# EAGLE design H1DR1x-T (EAGLE 9.6.1)

## Sheet 1 of 2
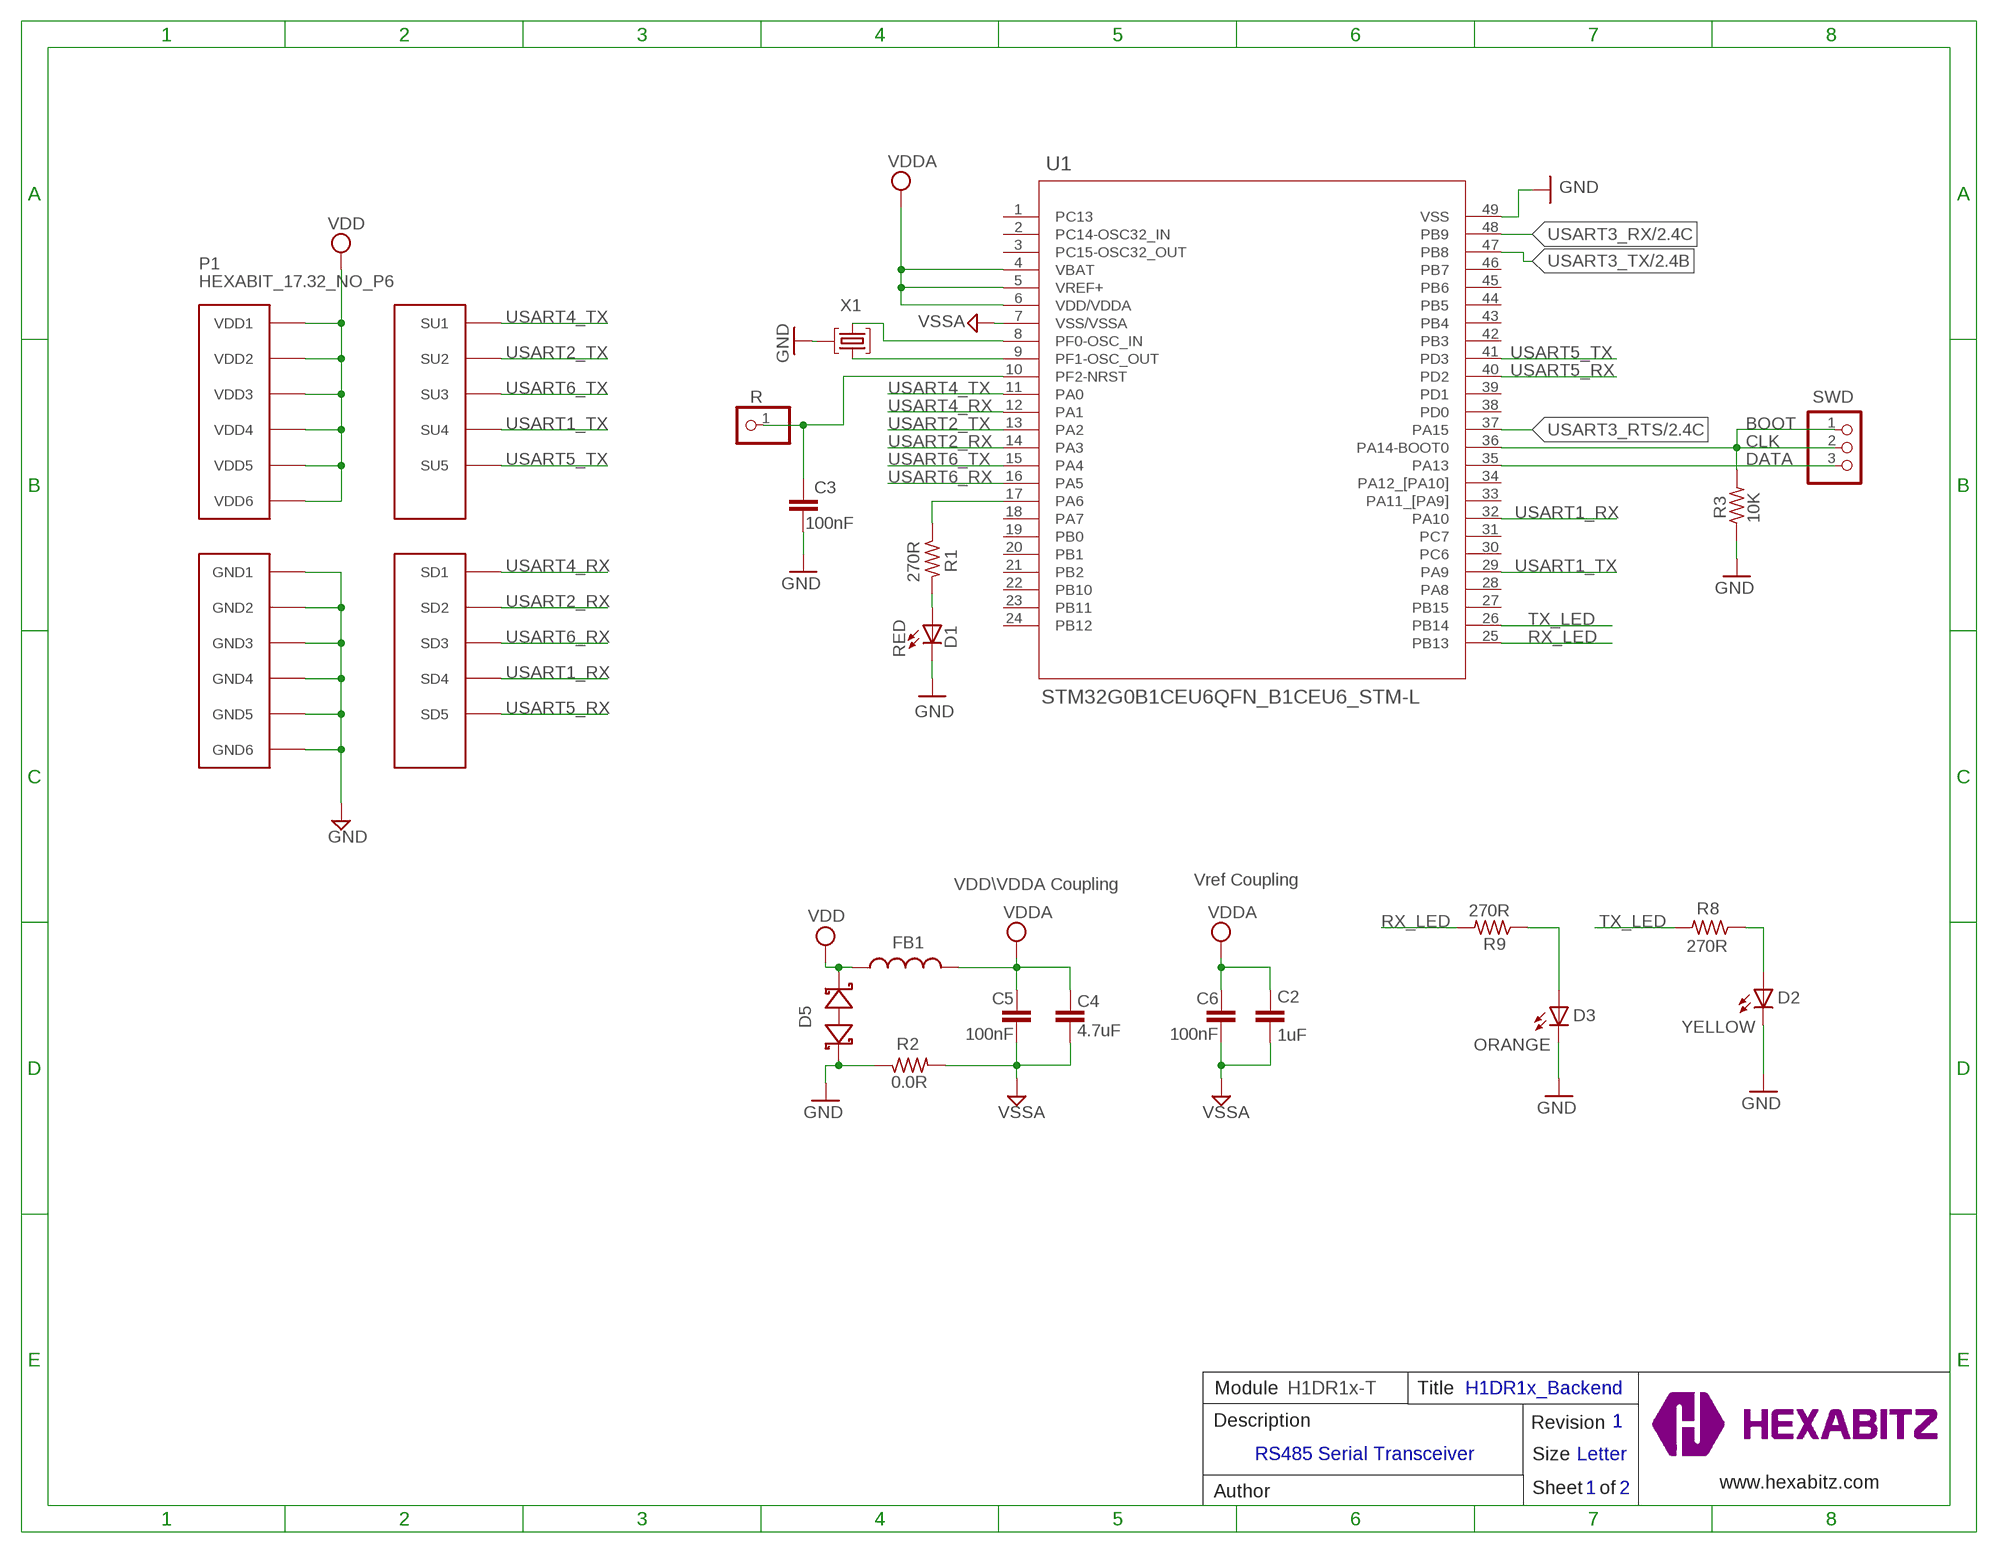
[diagram p0: schematic, sheet 1]

### Parts
C2  1uF  C-0805  [C-0805]
C3  100nF  C-0603  [C-0603]
C4  4.7uF  C-0805  [C-0805]
C5  100nF  C-0603  [C-0603]
C6  100nF  C-0603  [C-0603]
D1  RED  VLMS1300-GS08  [VLMS1300-GS08]
D2  YELLOW  VLMS1300-GS08  [VLMS1300-GS08]
D3  ORANGE  VLMS1300-GS08  [VLMS1300-GS08]
D5  BOURNS_CDSOD323-T03SCBOURNS_CDSOD323-T03SC_0_0  [BOURNS_CDSOD323-T03SC_0]
FB1  FB-TDK_MMZ1608Y300B  FB-0603  [FB-0603]
P1  HEXABIT_17.32_NO_P6  [HEXABIT_17.32_NO_P6]
R  R  PINHD-1X1  [1X01]
R1  270R  R-0603  [R-0603]
R2  0.0R  R-0603  [R-0603]
R3  10K  R-0603  [R-0603]
R8  270R  R-0603  [R-0603]
R9  270R  R-0603  [R-0603]
SWD  PINHD-1X3  [1X03]
TRIMBLE-LOGO1  HEXA-LOGO  [HEXA-LOGO]
U1  STM32G0B1CEU6QFN_B1CEU6_STM-L  [QFN_B1CEU6_STM-L]
X1  XTALL_CSTCE8M00G52  [XTALL_CSTCE8M00G52]

### Nets
CLK: R3.2 SWD.1 SWD.2 U1.36(PA14-BOOT0)
DATA: SWD.3 U1.35(PA13)
GND: C3.2 D1.C D2.C D3.C D5.1(A) P1.PAD_PD7(GND1) P1.PAD_PD8(GND2) P1.PAD_PD9(GND3) P1.PAD_PD10(GND4) P1.PAD_PD11(GND5) P1.PAD_PD12(GND6) R2.1 R3.1 U1.49(VSS) X1.P$2 ; also sheet 2
N$1: D1.A R1.2
N$3: R1.1 U1.17(PA6)
N$4: C3.1 R.1 U1.10(PF2-NRST)
N$5: U1.9(PF1-OSC_OUT) X1.P$1
N$6: U1.8(PF0-OSC_IN) X1.P$3
N$12: D3.A R9.1
N$13: D2.A R8.1
RX_LED: R9.2 U1.25(PB13)
TX_LED: R8.2 U1.26(PB14)
USART1_RX: P1.PAD_PD4(SD4) U1.32(PA10)
USART1_TX: P1.PAD_PU4(SU4) U1.29(PA9)
USART2_RX: P1.PAD_PD2(SD2) U1.14(PA3)
USART2_TX: P1.PAD_PU2(SU2) U1.13(PA2)
USART3_RTS: U1.37(PA15) ; also sheet 2
USART3_RX: U1.48(PB9) ; also sheet 2
USART3_TX: U1.47(PB8) ; also sheet 2
USART4_RX: P1.PAD_PD1(SD1) U1.12(PA1)
USART4_TX: P1.PAD_PU1(SU1) U1.11(PA0)
USART5_RX: P1.PAD_PD5(SD5) U1.40(PD2)
USART5_TX: P1.PAD_PU5(SU5) U1.41(PD3)
USART6_RX: P1.PAD_PD3(SD3) U1.16(PA5)
USART6_TX: P1.PAD_PU3(SU3) U1.15(PA4)
VDD: D5.2(C) FB1.2 P1.PAD_PU7(VDD1) P1.PAD_PU8(VDD2) P1.PAD_PU9(VDD3) P1.PAD_PU10(VDD4) P1.PAD_PU11(VDD5) P1.PAD_PU12(VDD6) ; also sheet 2
VDDA: C2.1 C4.1 C5.1 C6.1 FB1.1 U1.4(VBAT) U1.5(VREF+) U1.6(VDD/VDDA)
VSSA: C2.2 C4.2 C5.2 C6.2 R2.2 U1.7(VSS/VSSA)
Unconnected: U1.1(PC13) U1.2(PC14-OSC32_IN) U1.3(PC15-OSC32_OUT) U1.18(PA7) U1.19(PB0) U1.20(PB1) U1.21(PB2) U1.22(PB10) U1.23(PB11) U1.24(PB12) U1.27(PB15) U1.28(PA8) U1.30(PC6) U1.31(PC7) U1.33(PA11_[PA9]) U1.34(PA12_[PA10]) U1.38(PD0) U1.39(PD1) U1.42(PB3) U1.43(PB4) U1.44(PB5) U1.45(PB6) U1.46(PB7)

### Notes on the sheet
- BOOT
- VDD\VDDA Coupling | Vref Coupling
- Module | H1DR1x-T | Title | H1DR1x_Backend
- Description | Revision | 1
- RS485 Serial Transceiver
- Size | Letter
- www.hexabitz.com
- Author | Sheet   of | 1 | 2
- C:/Users/Admin/Desktop/logodraft.bmp

## Sheet 2 of 2
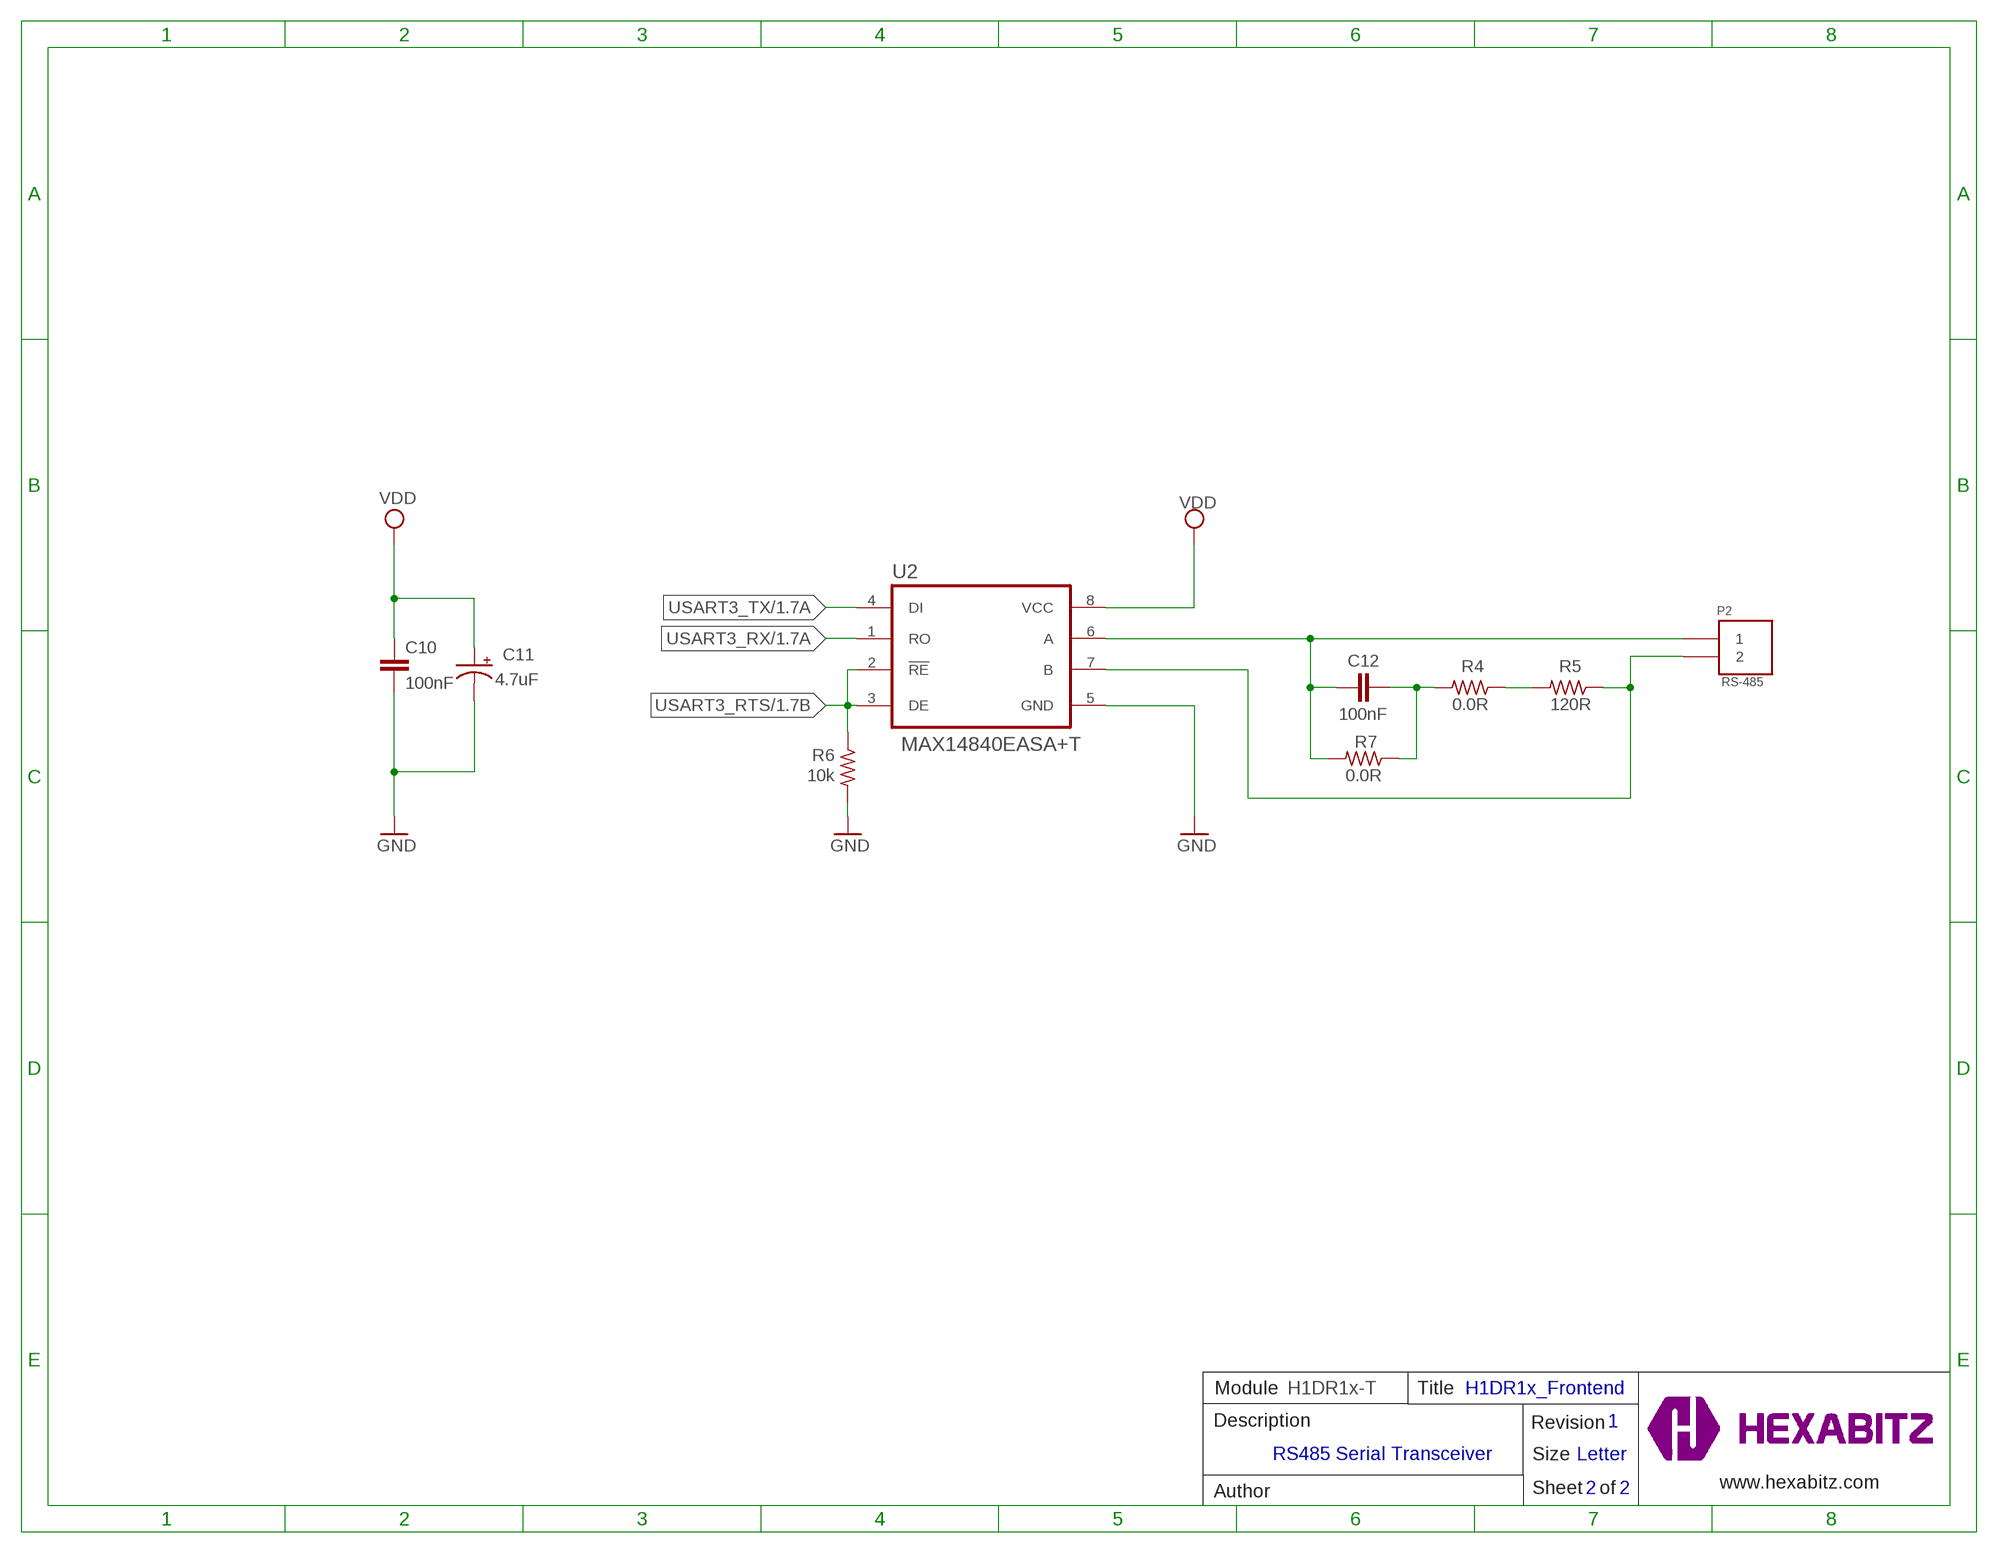
[diagram p1: schematic, sheet 2]

### Parts
C10  100nF  C-0603  [C-0603]
C11  4.7uF  C-0805-POL  [C-0805-POL]
C12  100nF  C-0603  [C-0603]
P2  RS-485  1546111-2  [1546111-2]
R4  0.0R  R-0603  [R-0603]
R5  120R  R-0603  [R-0603]
R6  10k  R-0603  [R-0603]
R7  0.0R  R-0603  [R-0603]
U2  MAX14840EASA+T  [SOIC127P600X175-8N]

### Nets
GND: C10.2 C11.2(-) R6.2 U2.5(GND) ; also sheet 1
N$2: C12.2 R4.2 R7.1
N$10: R4.1 R5.2
TA: C12.1 P2.1 R7.2 U2.6(A)
TB: P2.2 R5.1 U2.7(B)
USART3_RTS: R6.1 U2.2(!RE) U2.3(DE) ; also sheet 1
USART3_RX: U2.1(RO) ; also sheet 1
USART3_TX: U2.4(DI) ; also sheet 1
VDD: C10.1 C11.1(+) U2.8(VCC) ; also sheet 1

### Notes on the sheet
- Module | H1DR1x-T | Title | H1DR1x_Frontend
- Description | Revision | 1
- RS485 Serial Transceiver
- Size | Letter
- www.hexabitz.com
- Author | Sheet   of | 2 | 2

## Library data of the parts
C2 C4 = HEXABITZ_RCLS:C-0805: CAP CER 10% X7R 0805
C3 C5 C6 = HEXABITZ_RCLS:C-0603: CAP CER 10% X7R 0603
C10 = HEXABITZ_RCLS:C-0603: CAP CER 10% X7R 0603; CAPACITANCE: 100nF; MFN: KEMET; MPN: C0603C104K8RACTU; OCTOPART_URL: https://octopart.com/c0603c104k8ractu-kemet-145075?r=sp&s=9bS9ASSwSEqMCE9KBEQZ0g; TOLERANCE: 10%; VOLTAGE_RATING: 10V
C11 = HEXABITZ_RCLS:C-0805-POL: Cap Tant Solid SMD 2012; CAPACITANCE: 4.7uF; MFN: Murata; MPN: GRM21BC81E475KA12L; OCTOPART_URL: https://octopart.com/grm21bc81e475ka12l-murata-10331911?r=sp&s=RY3qZSD8T6mG6TC9CHI5qQ; TOLERANCE: 10%; VOLTAGE_RATING: 25V
C12 = HEXABITZ_RCLS:C-0603: CAP CER 10% X7R 0603; CAPACITANCE: 100nF; MFN: AVX; MPN: 0603YC104K4T2A; OCTOPART_URL: https://octopart.com/0603yc104k4t2a-avx+interconnect+%2F+elco-8120651; TOLERANCE: 10%; VOLTAGE_RATING: 16V
D1 = HEXABITZ_USER_INTERFACE_PARTS:VLMS1300-GS08: Red 0603 130° Clear 54 mcd 2 V Surface Mount ChipLED ; Octopart Url : http://octopart.com/vlms1300-gs08-vishay-21709201; MFN: Vishay; MPN: VLMS1300-GS08; OCTOPART_URL: https://octopart.com/vlms1300-gs08-vishay-21709201?r=sp&s=_gcP4_q8T1SC6PJQPTQ9yA
D2 D3 = HEXABITZ_USER_INTERFACE_PARTS:VLMS1300-GS08: Red 0603 130° Clear 54 mcd 2 V Surface Mount ChipLED ; Octopart Url : http://octopart.com/vlms1300-gs08-vishay-21709201; MFN: Vishay; MPN: VLMS1300-GS08; OCTOPART_URL: https://octopart.com/vlms1300-gs08-vishay-21709201?r=sp&s=_gcP4_q8T1SC6PJQPTQ9yA; VALUE: RED
D5 = HEXABITZ_RCLS:BOURNS_CDSOD323-T03SC: CDSOD323-TxxSC - TVS Diode Series; DESCRIPTION: Dio Tvs Vwm 03V 500W Bidir Sod323 / Tape & Reel - 7" Reel; MFN: Bourns; MPN: CDSOD323-T03SC; OCTOPART_URL: https://octopart.com/cdsod323-t03sc-bourns-10487153?r=sp
FB1 = HEXABITZ_RCLS:FB-0603: Ferrite Beads Multi-Layer 0603; MFN: TDK; MPN: MMZ1608Y300B; OCTOPART_URL: https://octopart.com/mmz1608y300b-tdk-368280?r=sp&s=cd9_2ZEqQ9q9UNBuQgHAiA
P1 = hexabitz_connectors:HEXABIT_?_NO_P6: Hexabitz Hexagon Module Connector Hexagon side length = 17.32mm. The following ports are removed: P6
P2 = HEXABITZ_CONNECTION_PARTS:1546111-2: Conn Shrouded Header HDR 2 POS 5.08mm Solder ST Thru-Hole; MFN: TE Connectivity; MPN: 1546111-2; OCTOPART_URL: https://octopart.com/1546111-2-te+connectivity-40393355
R = HEXABITZ_USER_INTERFACE_PARTS:PINHD-1X1: PIN HEADER; MFN: TE Connectivity; MPN: 87227-1; OCTOPART_URL: https://octopart.com/87227-1-te+connectivity-39512052?r=sp
R1 R3 R8 R9 = HEXABITZ_RCLS:R-0603: Thick Film Resistors - SMD 0603
R2 = HEXABITZ_RCLS:R-0603: Thick Film Resistors - SMD 0603; MFN: Yageo; MPN: RC0603JR-070RL; OCTOPART_URL: https://octopart.com/rc0603jr-070rl-yageo-1241539?r=sp&s=X2NteqRjRNWrnx42Y0aliA; RESISTANCE: 0.0 Ohm
R4 R7 = HEXABITZ_RCLS:R-0603: Thick Film Resistors - SMD 0603; MFN: Vishay; MPN: CRCW06030000Z0EA; OCTOPART_URL: https://octopart.com/crcw06030000z0ea-vishay-39556096#; RESISTANCE: 0.0 Ohm
R5 = HEXABITZ_RCLS:R-0603: Thick Film Resistors - SMD 0603; MFN: Panasonic; MPN: ERJP6WF1200V; OCTOPART_URL: https://octopart.com/erjp6wf1200v-panasonic-25949195?r=sp#; POWER_DISSIPATION: 0.5W; RESISTANCE: 120R; TOLERANCE: 1%
R6 = HEXABITZ_RCLS:R-0603: Thick Film Resistors - SMD 0603; MFN: Vishay; MPN: CRCW060310K0JNEB; OCTOPART_URL: https://octopart.com/crcw060310k0jneb-vishay+dale-46603268; RESISTANCE: 10k; TOLERANCE: 5%
SWD = pinhead:PINHD-1X3: PIN HEADER
TRIMBLE-LOGO1 = HEXABITZ_USER_INTERFACE_PARTS:HEXA-LOGO: Trimble-Logo
U1 = HEXABITZ_ICs:STM32G0B1CEU6; COPYRIGHT: Copyright (C) 2021 Ultra Librarian. All rights reserved.; MANUFACTURER_PART_NUMBER: STM32G0B1CEU6; MFR_NAME: STMicroelectronics; SPICEPREFIX: X
U2 = HEXABITZ_ICs:MAX14840EASA+T: Check availability <https://pricing.snapeda.com/parts/MAX14840EASA%2BT/Analog%20Devices/view-part?ref=eda>; AVAILABILITY: In Stock; CHECK_PRICES: https://www.snapeda.com/parts/MAX14840EASA+T/Analog+Devices/view-part/?ref=eda; DESCRIPTION: 40Mbps, +3.3V, RS-485 Half-Duplex Transceivers; MF: Analog Devices; MP: MAX14840EASA+T; PACKAGE: SOIC-8 Maxim; PRICE: None; SNAPEDA_LINK: https://www.snapeda.com/parts/MAX14840EASA+T/Analog+Devices/view-part/?ref=snap
X1 = HEXABITZ_RCLS:XTALL_CSTCE8M00G52: MURATA CSTCE8M00G52-R0 RESONATOR, SMD, 8MHZ ; Octopart Url : https://octopart.com/cstce8m00g52-r0-murata-7145559; MFN: Murata; MPN: CSTCE8M00G52Z-R0; OCTOPART_URL: https://octopart.com/cstce8m00g52z-r0-murata-17755941?r=sp&s=JDnNJnrHQhyS8Zk4ofFWXw

## Board
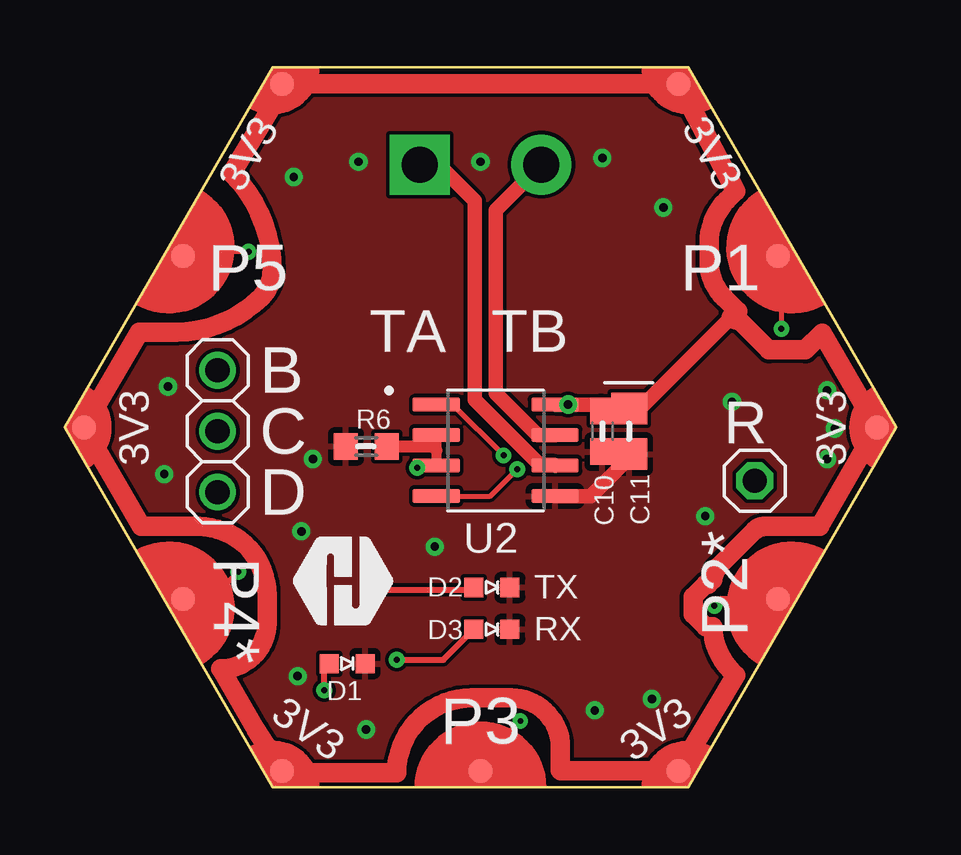
[diagram p2: board, top side]
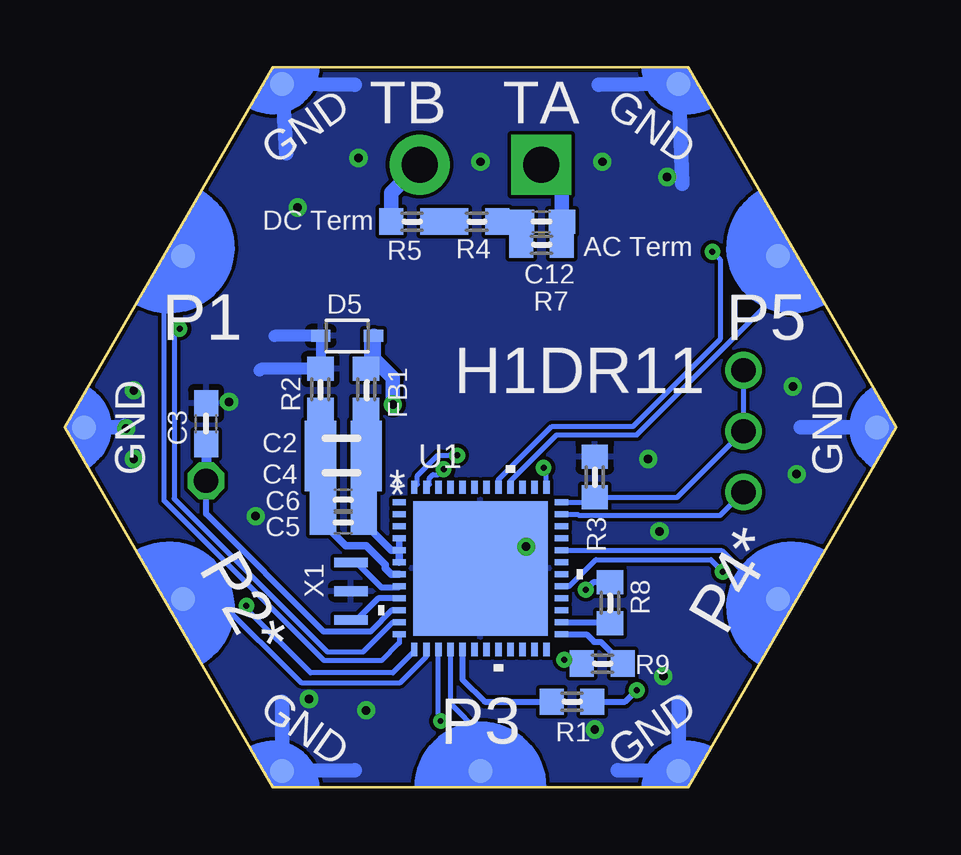
[diagram p3: board, bottom side, seen from below]

Size 34.64 x 30 mm. Coordinates in mm from the lower left corner, seen from the top.
Copper layers (1*16): Top 0.035mm / dielectric 1.5mm / Bottom 0.035mm
Design rules "2_layer *": minimum track width 7mil, minimum drill 9mil, track to track 6mil, track to pad 6mil, pad to pad 6mil, via to via 6mil, smd to smd 0mil, copper to edge 0.15mm, drill to drill 8mil, minimum pad ring 10mil, minimum via ring 8mil, stop-mask expansion 2mil, vias tented up to drill 15mil, thermal gap 10mil

### Footprints (pad centres in the part's own frame; a part is rotated, then mirrored left to right if it is on the bottom)
C-0805 = smd 1.3 x 1.5: 1 -0.95,0; 2 0.95,0
C-0603 = smd 1.1 x 1: 1 -0.85,0; 2 0.85,0
C-0805-POL = smd 1.3 x 1.5: 1 -0.95,0; 2 0.95,0
VLMS1300-GS08 = smd 0.8 x 0.8: A 0,0.75; C 0,-0.75
BOURNS_CDSOD323-T03SC_0 = smd 0.8 x 0.5: 1 -1.1,0; 2 1.1,0
FB-0603 = smd 1 x 1.1: 1 -0.85,0; 2 0.85,0
HEXABIT_17.32_NO_P6 = smd 1 x 1 bottom: PAD_PD1 12.39,7.15; PAD_PD2 12.39,-7.15; PAD_PD3 0,-14.31; PAD_PD4 -12.39,-7.15; PAD_PD5 -12.39,7.15; PAD_PD7 8.26,14.31; PAD_PD8 16.52,0; PAD_PD9 8.26,-14.31; PAD_PD10 -8.26,-14.31; PAD_PD11 -16.52,0; PAD_PD12 -8.26,14.31 | smd 1 x 1: PAD_PU1 12.39,7.15; PAD_PU2 12.39,-7.15; PAD_PU3 0,-14.31; PAD_PU4 -12.39,-7.15; PAD_PU5 -12.39,7.15; PAD_PU7 8.26,14.31; PAD_PU8 16.52,0; PAD_PU9 8.26,-14.31; PAD_PU10 -8.26,-14.31; PAD_PU11 -16.52,0; PAD_PU12 -8.26,14.31
1546111-2 = drill 1.5 pad 2.5 square: 1 -2.54,0 | drill 1.5 pad 2.5: 2 2.54,0
1X01 = drill 1.016 octagon: 1 0,0
R-0603 = smd 1 x 1.1: 1 -0.85,0; 2 0.85,0
1X03 = drill 1.016: 1 -2.54,0; 2 0,0; 3 2.54,0
QFN_B1CEU6_STM-L = smd 0.55 x 0.254: 1 -3.38,2.751; 2 -3.38,2.251; 3 -3.38,1.75; 4 -3.38,1.25; 5 -3.38,0.75; 6 -3.38,0.25; 7 -3.38,-0.25; 8 -3.38,-0.75; 9 -3.38,-1.25; 10 -3.38,-1.75; 11 -3.38,-2.251; 12 -3.38,-2.751; 25 3.38,-2.751; 26 3.38,-2.251; 27 3.38,-1.75; 28 3.38,-1.25; 29 3.38,-0.75; 30 3.38,-0.25; 31 3.38,0.25; 32 3.38,0.75; 33 3.38,1.25; 34 3.38,1.75; 35 3.38,2.251; 36 3.38,2.751 | smd 0.254 x 0.55: 13 -2.751,-3.38; 14 -2.251,-3.38; 15 -1.75,-3.38; 16 -1.25,-3.38; 17 -0.75,-3.38; 18 -0.25,-3.38; 19 0.25,-3.38; 20 0.75,-3.38; 21 1.25,-3.38; 22 1.75,-3.38; 23 2.251,-3.38; 24 2.751,-3.38; 37 2.751,3.38; 38 2.251,3.38; 39 1.75,3.38; 40 1.25,3.38; 41 0.75,3.38; 42 0.25,3.38; 43 -0.25,3.38; 44 -0.75,3.38; 45 -1.25,3.38; 46 -1.75,3.38; 47 -2.251,3.38; 48 -2.751,3.38 | smd 5.6 x 5.6: 49 0,0
SOIC127P600X175-8N = smd 1.97 x 0.59: 1 -2.475,1.905; 2 -2.475,0.635; 3 -2.475,-0.635; 4 -2.475,-1.905; 5 2.475,-1.905; 6 2.475,-0.635; 7 2.475,0.635; 8 2.475,1.905
XTALL_CSTCE8M00G52 = smd 1.4 x 0.4: P$1 0,1.2; P$2 0,0; P$3 0,-1.2

### Placement (x,y rotation side)
C2  23.04,14.52 180 bottom
C3  28.75,15.16 90 bottom
C4  23.04,13.09 180 bottom
C5  23.04,11.03 180 bottom
C6  23.04,11.98 180 bottom
C10  22.4,14.84 270 top
C11  23.51,14.84 270 top
C12  14.78,23.57 180 bottom
D1  11.76,5.16 90 top
D2  17.8,8.33 90 top
D3  17.8,6.59 90 top
D5  22.88,18.81 0 bottom
FB1  22.08,16.59 90 bottom
P1  17.32,15 0 top
P2  17.32,25.95 0 top
R  28.75,12.78 90 top
R1  13.51,3.57 0 bottom
R2  23.99,16.59 270 bottom
R3  12.56,12.94 270 bottom
R4  17.48,23.57 0 bottom
R5  20.18,23.57 0 bottom
R6  12.56,14.21 180 top
R7  14.78,22.62 0 bottom
R8  11.92,7.7 270 bottom
R9  12.24,5.16 0 bottom
SWD  6.37,14.84 270 top
TRIMBLE-LOGO1  11.61,6.74 0 top
U1  17.32,9.13 0 bottom
U2  17.96,14.05 0 top
X1  22.72,8.17 180 bottom

### Tracks (layer width: path | path; a pad name or v marks a point on that pad's centre or on a via)
CLK
  Bottom 0.203: U1.36 12.77,11.88 R3.2 9.12,12.09 SWD.2 SWD.1
DATA
  Bottom 0.203: U1.35 13.26,11.38 13.21,11.33 7.34,11.33 SWD.3
GND  (via drill 0.35 pad 0.75)
  Top 0.508: C11.2 22.5,13.89 C10.2
  Top 0.61: U2.5 21.92,12.14 23.43,13.65 23.35,13.73 | 23.35,13.73 C11.2 | C10.2 23.09,13.99 23.35,13.73
  Bottom 0.406: D5.1 23.98,17.45 R2.1
  Bottom 0.508: D5.1 25.89,18.81 | R2.1 26.47,17.44 26.53,17.38 | U1.49 17.32,9.56 18.27,7.11
  Bottom 0.61: 9.06,3.57 P1.PAD_PD10 11.61,0.71 | P1.PAD_PD11 3.98,15 | 8.91,25.16 P1.PAD_PD12 12.4,29.29 | 22.56,29.29 P1.PAD_PD7 25.42,26.43 | 25.58,3.57 P1.PAD_PD9 22.56,0.71 | 18.27,7.11 18.11,10.24 | 32.16,15.07 32.09,15 P1.PAD_PD8 | U1.49 16.41,10.03 v15.42,10.03
  other vias: 32.08,14.96 31.77,16.54 31.77,13.69 27.8,16.07 26.69,11.3 9.7,4.64 12.56,2.41 22.08,3.21 24.46,3.68 4.3,16.7 4.14,13.05 9.54,25.43 12.24,26.07 17.32,26.07 24.94,24.16 22.4,26.23 9.86,10.67 10.34,13.69
  pour Bottom: 8.74,-0.02 26.06,-0.02 34.72,14.98 26.06,29.98 8.74,29.98 0.08,14.98
  pour Top: 8.74,-0.02 26.06,-0.02 34.72,14.98 26.06,29.98 8.74,29.98 0.08,14.98
N$1  (via drill 0.25 pad 0.55)
  Top 0.254: v10.81,4.05 10.81,4.95 D1.A
  Bottom 0.254: R1.2 11.29,3.57 v10.81,4.05
N$2
  Bottom 0.61: R4.2 C12.2 R7.1
N$3
  Bottom 0.254: U1.17 18.07,4.5 17.14,3.57 R1.1
N$4
  Bottom 0.203: 22.88,6.49 22.86,6.48
  Bottom 0.254: R.1 28.75,11.39 23.85,6.49 22.88,6.49 21.9,6.49 21.02,7.38 U1.10
  Bottom 0.406: C3.1 R.1
N$5
  Bottom 0.254: U1.9 21.59,7.88 22.49,6.97 X1.P$1
N$6
  Bottom 0.254: X1.P$3 22.49,9.37 21.45,8.33 20.74,8.33 U1.8
N$10
  Bottom 0.61: R4.1 R5.2
N$12  (via drill 0.25 pad 0.55)
  Top 0.254: v13.83,5.32 15.78,5.32 D3.A
  Bottom 0.254: R9.1 13.67,5.16 v13.83,5.32
N$13  (via drill 0.25 pad 0.55)
  Top 0.254: v12.94,8.24 16.95,8.24 D2.A
  Bottom 0.254: R8.1 12.63,8.55 v12.94,8.24
RX_LED
  Bottom 0.254: R9.2 12.3,6.07 12.59,6.07 12.9,6.38 U1.25
TA
  Top 0.61: P2.1 15.57,25.95 17.08,24.44 17.08,16.15 19.79,13.44 20.4,13.44 U2.6
  Bottom 0.61: P2.1 13.93,25.1 C12.1 R7.2
TB
  Top 0.61: U2.7 19.7,14.68 17.96,16.43 17.96,24.05 P2.2
  Bottom 0.61: R5.1 21.03,24.79 P2.2
TX_LED
  Bottom 0.254: U1.26 11.95,6.88 R8.2
USART1_RX
  Bottom 0.203: U1.32 7.27,9.88 5.25,7.85 P1.PAD_PD4
USART1_TX  (via drill 0.25 pad 0.55)
  Top 0.203: P1.PAD_PU4 6.09,7.85 v7.22,8.99
  Bottom 0.203: v7.22,8.99 7.72,9.49 12.51,9.49 13.62,8.38 U1.29
USART2_RX
  Bottom 0.203: P1.PAD_PD2 28.28,7.85 24.8,4.36 20.65,4.36 19.57,5.45 U1.14
USART2_TX  (via drill 0.25 pad 0.55)
  Top 0.254: P1.PAD_PU2 27.35,7.85 v27.07,7.57
  Bottom 0.203: U1.13 20.07,5.67 20.97,4.77 24.39,4.77 27.07,7.45 v27.07,7.57
USART3_RTS  (via drill 0.25 pad 0.55)
  Top 0.203: v14.69,13.32 14.78,13.41 U2.3
  Top 0.406: U2.2 15.48,14.05 U2.3
  Top 0.508: R6.1 15.32,14.21 15.48,14.05
  Bottom 0.203: U1.37 14.57,13.2 v14.69,13.32
USART3_RX  (via drill 0.25 pad 0.55)
  Top 0.203: v18.29,13.83 16.17,15.95 U2.1
  Bottom 0.203: U1.48 19.95,12.63 19.95,12.99 19.1,13.84 18.62,13.84 18.61,13.83 v18.29,13.83
USART3_TX  (via drill 0.25 pad 0.55)
  Top 0.203: U2.4 17.74,12.14 v18.86,13.26
  Bottom 0.203: U1.47 19.45,12.63 19.45,12.89 19.3,13.04 19.08,13.04 v18.86,13.26
USART4_RX
  Bottom 0.203: U1.12 20.7,6.02 21.44,5.28 23.84,5.28 30.5,11.94 30.5,19.92 29.71,20.71 P1.PAD_PD1
USART4_TX  (via drill 0.25 pad 0.55)
  Top 0.203: v29.86,19.12 29.86,22 P1.PAD_PU1
  Bottom 0.203: U1.11 20.98,6.88 22.22,5.64 23.69,5.64 30.08,12.03 30.08,18.89 v29.86,19.12
USART5_RX
  Bottom 0.203: P1.PAD_PD5 4.93,20.56 10.8,14.69 14.15,14.69 16.07,12.77 U1.40
USART5_TX  (via drill 0.25 pad 0.55)
  Top 0.203: v7.66,22.32 5.1,22.32 P1.PAD_PU5
  Bottom 0.203: v7.66,22.32 7.34,22 7.34,18.67 10.96,15.05 14.35,15.05 16.57,12.82 U1.41
USART6_RX
  Bottom 0.203: P1.PAD_PD3 17.32,2.23 18.56,3.48 U1.16
USART6_TX  (via drill 0.23 pad 0.55)
  Top 0.203: P1.PAD_PU3 17.32,1.11 v18.98,2.77
  Bottom 0.203: v18.98,2.77 18.98,2.96 19.07,3.05 U1.15
VDD  (via drill 0.35 pad 0.75)
  Top 0.508: 22.14,15.95 C10.1 22.5,15.79 | U2.8 v20.97,15.95
  Top 0.61: U2.8 22.34,15.95 22.5,15.79 C11.1 23.97,15.79 27.78,19.6
  Top 0.813: 27,6.69 arc45 27.75,4.89 27.96,4.68 P1.PAD_PU9 20.68,0.69 arc-90 20.65,0.71 20.65,1.66 arc90 18.59,3.73 16.95,3.73 arc90 13.83,0.61 9.14,0.61 P1.PAD_PU10 7.98,2.39 6.51,4.94 arc90 8.43,6.86 8.43,8.01 arc90 5.57,10.87 3.19,10.87 P1.PAD_PU11 3.1,18.97 4.65,18.97 arc45 8.18,20.43 arc45 8.64,21.54 arc45 6.96,25.58 9.06,29.1 P1.PAD_PU12 P1.PAD_PU7 27.96,24.84 27.59,24.47 arc45 26.84,22.68 26.84,21.93 arc45 27.48,20.4 28.03,19.85 | C11.1 23.63,15.91 | 27.78,19.6 arc45 28.1,19.46 29.33,18.23 30.86,18.23 31.56,18.93 P1.PAD_PU8 31.45,10.87 29.13,10.87 arc45 28.75,10.71 27.23,9.19 arc45 27,8.65 26.81,8.46 26.7,8.46 26.18,7.94 26.18,7.21 26.7,6.69 27,6.69 | 27,6.69
  Bottom 0.508: D5.2 21.92,18.66 21.92,17.6 FB1.2
  Bottom 0.61: v20.97,15.95 20.97,17.06 21.78,17.87 D5.2
VDDA
  Bottom 0.254: 20.7,9.92 U1.4 U1.5
  Bottom 0.305: 20.7,9.92 U1.6 | U1.5 21.03,9.88 C5.1
  Bottom 0.508: FB1.1 C2.1 C4.1 22.09,12.08 C6.1 C5.1
VSSA
  Bottom 0.305: U1.7 21.03,8.88 21.28,9.12 21.28,9.28 22.08,10.08 22.93,10.08 C5.2 C6.2 23.98,12.08 C4.2
  Bottom 0.508: R2.2 C2.2 C4.2

### Text on the board
tPlace: 3V3 | 3V3 | P5 | P1 | B | 3V3 | 3V3 | C | D | P2* | TX | P4* | RX | 3V3 | P3 | 3V3
bPlace: GND | GND | P5 | P1 | H1DR11 | GND | GND | * | P4* | P2* | GND | P3 | GND
tNames: TA | TB
bNames: TA | TB | DC Term | AC Term